# EAGLE design encoder (EAGLE 6.5.0)
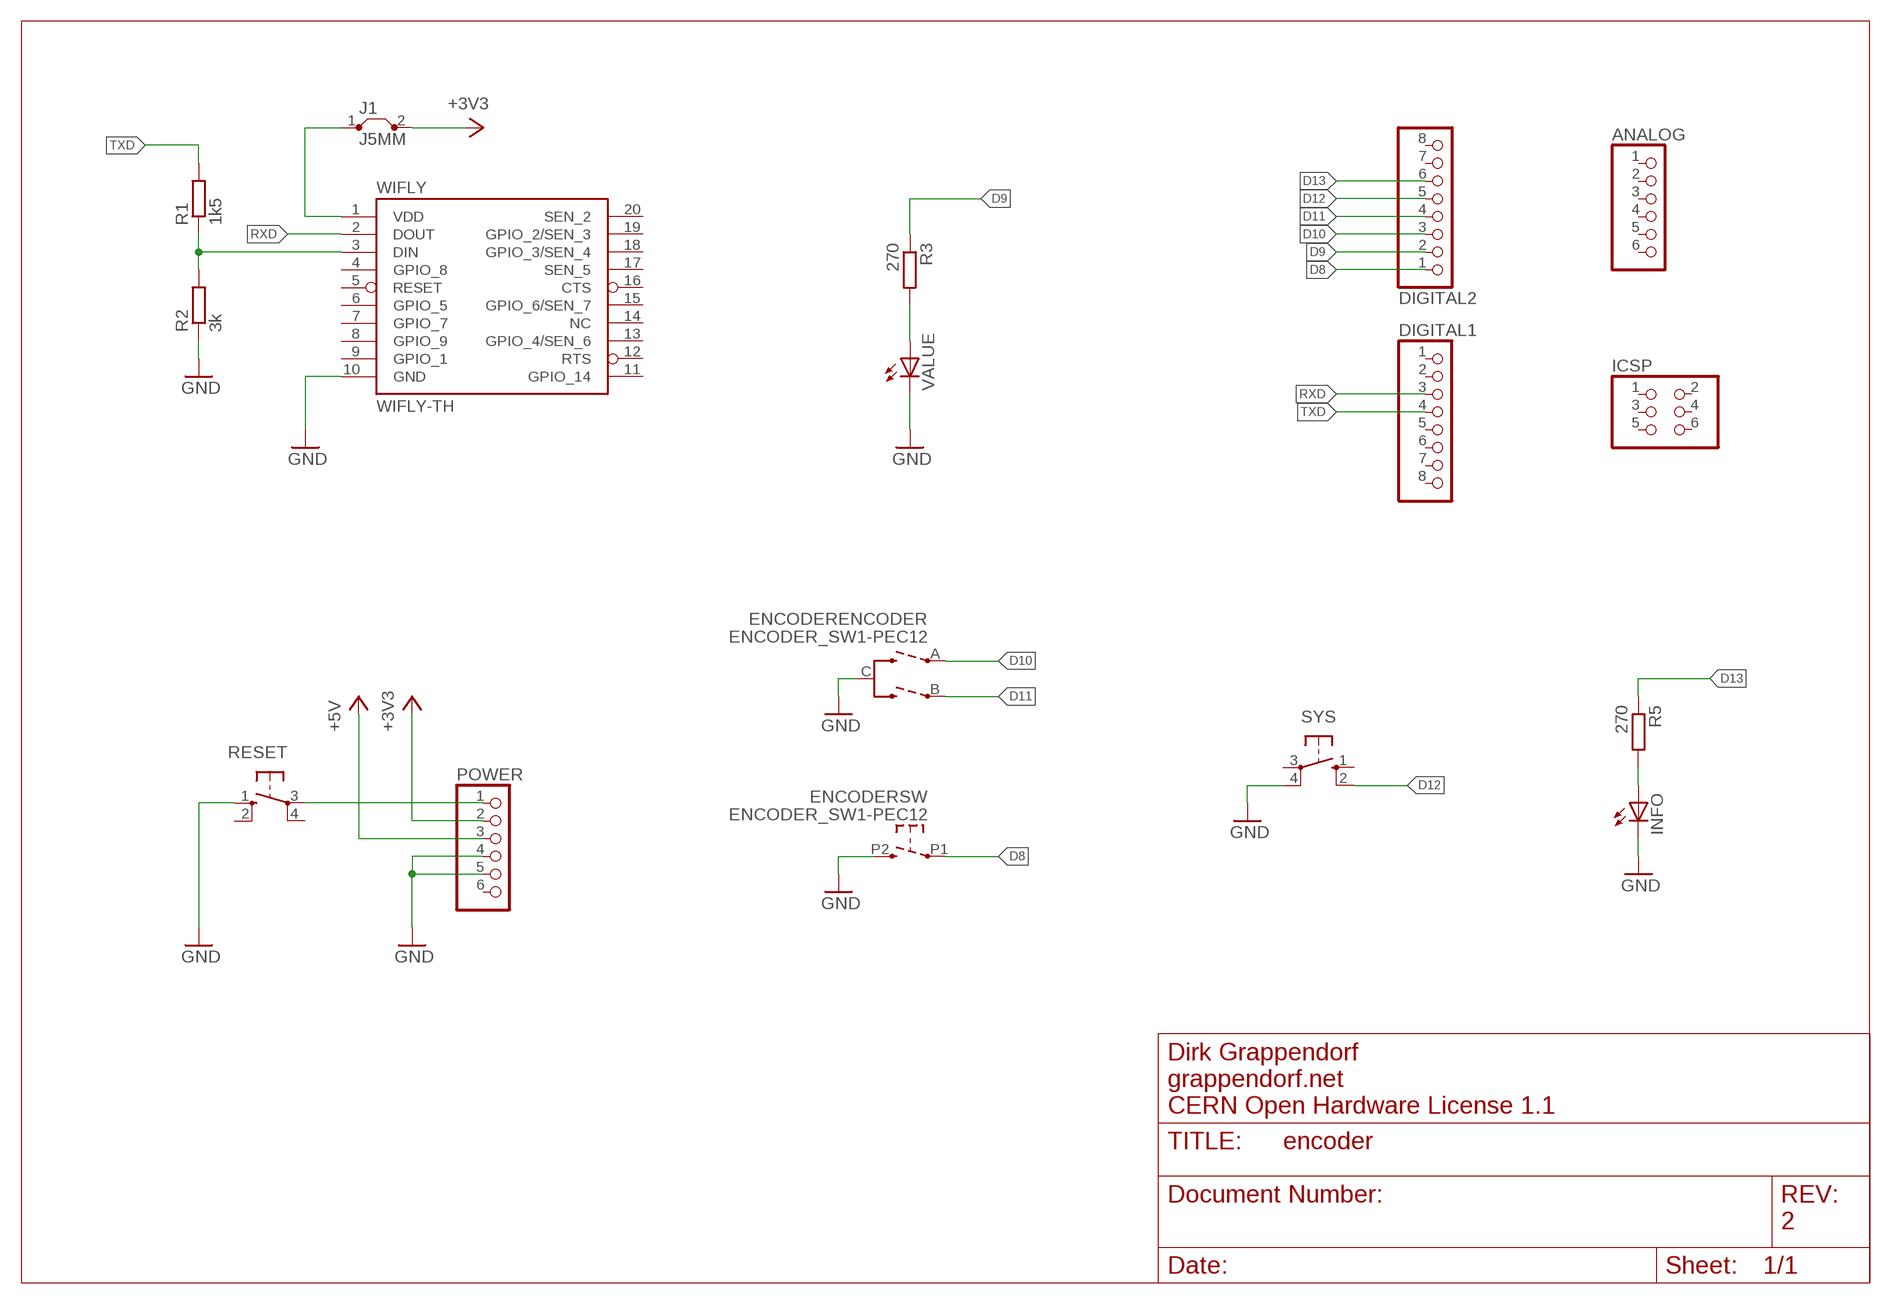
[diagram p0: schematic, sheet 1]

## Parts
ANALOG  PINHD-1X6  [1X06]
DIGITAL1  PINHD-1X8TH  [1X08-TH]
DIGITAL2  PINHD-1X8_2.54  [1X08]
ENCODER  ENCODER_SW1-PEC12  [PEC12_INCREMENTAL_ENCODER]
ICSP  PINHD-2X3  [2X03]
INFO  LED3MM  [LED3MM]
J1  J5MM  [05]
POWER  PINHD-1X6_2.54  [1X06]
R1  1k5  R-EU_0204/7  [0204/7]
R2  3k  R-EU_0204/7  [0204/7]
R3  270  R-EU_0204/7  [0204/7]
R5  270  R-EU_0204/7  [0204/7]
RESET  10-XX  [B3F-10XX]
SYS  10-XX  [B3F-10XX]
VALUE  LED3MM  [LED3MM]
WIFLY  WIFLY-TH  [WIFLY-TH]

## Nets
+3V3: J1.2 POWER.2
+5V: POWER.3
D8: DIGITAL2.1 ENCODER.P1
D9: DIGITAL2.2 R3.1
D10: DIGITAL2.3 ENCODER.A(ENCODER:A)
D11: DIGITAL2.4 ENCODER.B(ENCODER:B)
D12: DIGITAL2.5 SYS.2(S1)
D13: DIGITAL2.6 R5.1
GND: ENCODER.C(ENCODER:C) ENCODER.P2 INFO.K(C) POWER.4 POWER.5 R2.1 RESET.1(S) SYS.4(P1) VALUE.K(C) WIFLY.10(GND)
N$1: R1.1 R2.2 WIFLY.3(DIN)
N$2: POWER.1 RESET.3(P)
N$3: J1.1 WIFLY.1(VDD)
N$4: R3.2 VALUE.A
N$7: INFO.A R5.2
RXD: DIGITAL1.3 WIFLY.2(DOUT)
TXD: DIGITAL1.4 R1.2
Unconnected: ANALOG.1 ANALOG.2 ANALOG.3 ANALOG.4 ANALOG.5 ANALOG.6 DIGITAL1.1 DIGITAL1.2 DIGITAL1.5 DIGITAL1.6 DIGITAL1.7 DIGITAL1.8 DIGITAL2.7 DIGITAL2.8 ICSP.1 ICSP.2 ICSP.3 ICSP.4 ICSP.5 ICSP.6 POWER.6 RESET.2(S1) RESET.4(P1) SYS.1(S) SYS.3(P) WIFLY.4(GPIO_8) WIFLY.5(RESET) WIFLY.6(GPIO_5) WIFLY.7(GPIO_7) WIFLY.8(GPIO_9) WIFLY.9(GPIO_1) WIFLY.11(GPIO_14) WIFLY.12(RTS) WIFLY.13(GPIO_4/SEN_6) WIFLY.14(NC) WIFLY.15(GPIO_6/SEN_7) WIFLY.16(CTS) WIFLY.17(SEN_5) WIFLY.18(GPIO_3/SEN_4) WIFLY.19(GPIO_2/SEN_3) WIFLY.20(SEN_2)

## Notes on the sheet
- Dirk Grappendorf
- grappendorf.net
- CERN Open Hardware License 1.1
- 2

## Library data of the parts
ANALOG = pinhead:PINHD-1X6: PIN HEADER
DIGITAL1 = SmartPrj:PINHD-1X8: PIN HEADER
DIGITAL2 = pinhead-1:PINHD-1X8: PIN HEADER
ENCODER = dp_devices:ENCODER_SW1: Incremental Encoder with push switch
ICSP = SmartPrj:PINHD-2X3: PIN HEADER
INFO VALUE = led:LED: LED OSRAM: - CHIPLED LG R971, LG N971, LY N971, LG Q971, LY Q971, LO R971, LY R971 LH N974, LH R974 LS Q976, LO Q976, LY Q976 LO Q996 - Hyper CHIPLED LW Q18S LB Q993, LB Q99A, LB R99A - SideLED LS A670, LO A670, LY A670, LG A670, LP A670 LB A673, LV A673, LT A673, LW A673 LH A674 LY A675 LS A676, LA A676, LO A676, LY A676, LW A676 LS A679, LY A679, LG A679 - Hyper Micro SIDELED® LS Y876, LA Y876, LO Y876, LY Y876 LT Y87S - SmartLED LW L88C, LW L88S LB L89C, LB L89S, LG L890 LS L89K, LO L89K, LY L89K LS L896, LA L896, LO L896, LY L896 - TOPLED LS T670, LO T670, LY T670, LG T670, LP T670 LSG T670, LSP T670, LSY T670, LOP T670, LYG T670 LG T671, LOG T671, LSG T671 LB T673, LV T673, LT T673, LW T673 LH T674 LS T676, LA T676, LO T676, LY T676, LB T676, LH T676, LSB T676, LW T676 LB T67C, LV T67C, LT T67C, LS T67K, LO T67K, LY T67K, LW E67C LS E67B, LA E67B, LO E67B, LY E67B, LB E67C, LV E67C, LT E67C LW T67C LS T679, LY T679, LG T679 LS T770, LO T770, LY T770, LG T770, LP T770 LB T773, LV T773, LT T773, LW T773 LH T774 LS E675, LA E675, LY E675, LS T675 LS T776, LA T776, LO T776, LY T776, LB T776 LHGB T686 LT T68C, LB T68C - Hyper Mini TOPLED® LB M676 - Mini TOPLED Santana® LG M470 LS M47K, LO M47K, LY M47K Source: http://www.osram.convergy.de LUXEON: - LUMILED® LXK2-PW12-R00, LXK2-PW12-S00, LXK2-PW14-U00, LXK2-PW14-V00 LXK2-PM12-R00, LXK2-PM12-S00, LXK2-PM14-U00 LXK2-PE12-Q00, LXK2-PE12-R00, LXK2-PE12-S00, LXK2-PE14-T00, LXK2-PE14-U00 LXK2-PB12-K00, LXK2-PB12-L00, LXK2-PB12-M00, LXK2-PB14-N00, LXK2-PB14-P00, LXK2-PB14-Q00 LXK2-PR12-L00, LXK2-PR12-M00, LXK2-PR14-Q00, LXK2-PR14-R00 LXK2-PD12-Q00, LXK2-PD12-R00, LXK2-PD12-S00 LXK2-PH12-R00, LXK2-PH12-S00 LXK2-PL12-P00, LXK2-PL12-Q00, LXK2-PL12-R00 Source: www.luxeon.com KINGBRIGHT: KA-3528ASYC Source: www.kingbright.com
J1 = jumper:J: Bridge
POWER = pinhead-1:PINHD-1X6: PIN HEADER
R1-R3 R5 = rcl:R-EU_: RESISTOR, European symbol
RESET SYS = switch-omron:10-XX: OMRON SWITCH
WIFLY = grapelabs:WIFLY

## Board
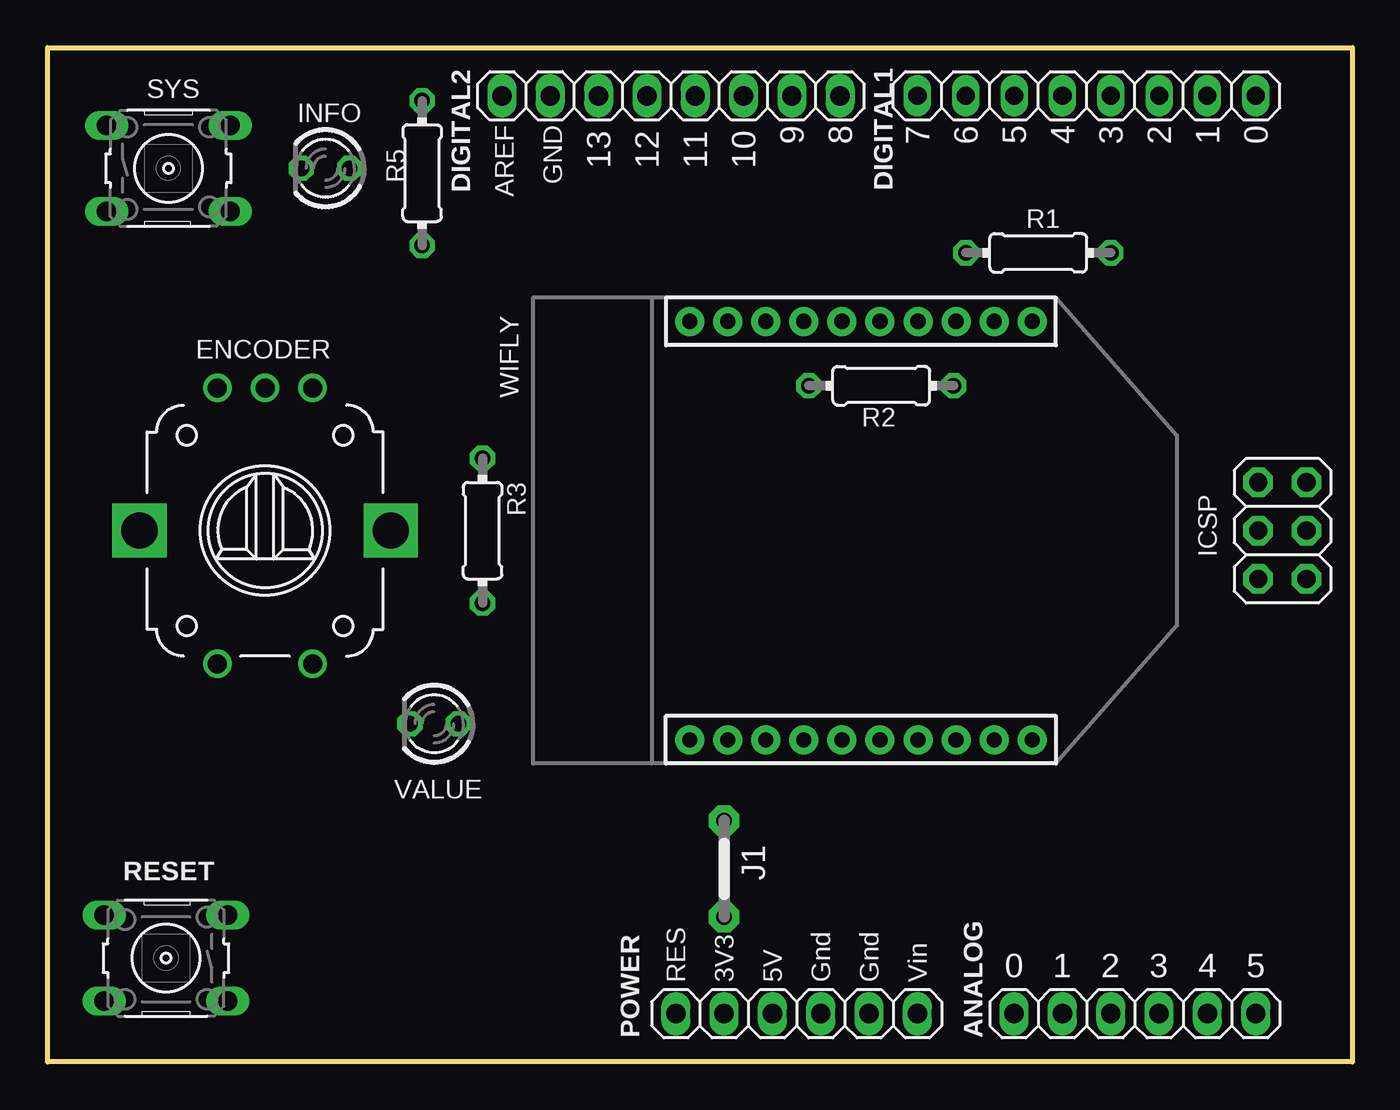
[diagram p1: board, top side]
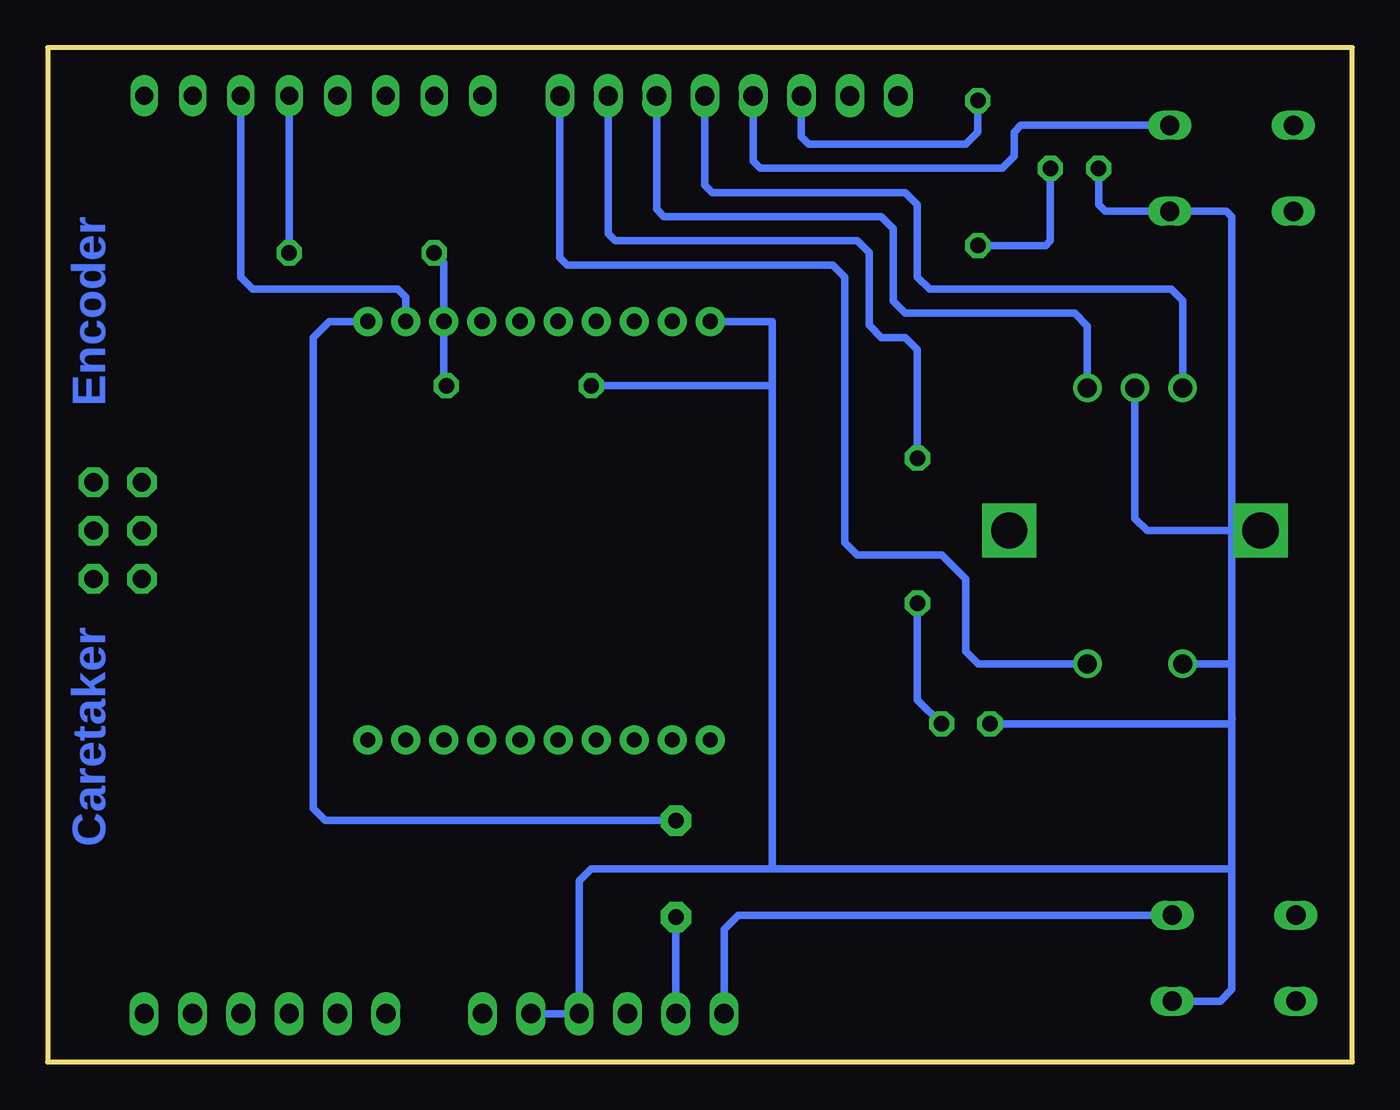
[diagram p2: board, bottom side, seen from below]

Size 68.58 x 53.34 mm. Coordinates in mm from the lower left corner, seen from the top.
Outline: 68.58,53.34 68.58,0 0,0 0,53.34 68.58,53.34
Copper layers (1*16): Top 0.035mm / dielectric 1.5mm / Bottom 0.035mm
Design rules "default": minimum track width 10mil, minimum drill 24mil, track to track 8mil, track to pad 8mil, pad to pad 8mil, via to via 8mil, smd to smd 8mil, copper to edge 40mil, drill to drill 8mil, minimum pad ring 10mil, minimum via ring 8mil, stop-mask expansion 2mil, vias tented up to drill 0mil, thermal gap 10mil

### Footprints (pad centres in the part's own frame; a part is rotated, then mirrored left to right if it is on the bottom)
1X06 = drill 1.016 long: 1 -6.35,0; 2 -3.81,0; 3 -1.27,0; 4 1.27,0; 5 3.81,0; 6 6.35,0
1X08-TH = drill 0.95 pad 1.422 long: 1 -8.89,0; 2 -6.35,0; 3 -3.81,0; 4 -1.27,0; 5 1.27,0; 6 3.81,0; 7 6.35,0; 8 8.89,0
1X08 = drill 1.016 long: 1 -8.89,0; 2 -6.35,0; 3 -3.81,0; 4 -1.27,0; 5 1.27,0; 6 3.81,0; 7 6.35,0; 8 8.89,0
PEC12_INCREMENTAL_ENCODER = drill 1: A -2.5,-7.5; B 2.5,-7.5; C 0,-7.5; P1 -2.5,7; P2 2.5,7 | drill 1.9 square: GND@1 -6.6,0; GND@2 6.6,0
2X03 = drill 0.95 pad 1.55 octagon: 1 -2.54,-1.27; 2 -2.54,1.27; 3 0,-1.27; 4 0,1.27; 5 2.54,-1.27; 6 2.54,1.27
LED3MM = drill 0.813 octagon: A -1.27,0; K 1.27,0
05 = drill 0.813 pad 1.6 octagon: 1 -2.54,0; 2 2.54,0
0204/7 = drill 0.813 octagon: 1 -3.81,0; 2 3.81,0
B3F-10XX = drill 1.016 long: 1 -3.251,2.261; 2 3.251,2.261; 3 -3.251,-2.261; 4 3.251,-2.261
WIFLY-TH = drill 0.8 pad 1.524: 1 -11,20; 2 -11,18; 3 -11,16; 4 -11,14; 5 -11,12; 6 -11,10; 7 -11,8; 8 -11,6; 9 -11,4; 10 -11,2; 11 11,2; 12 11,4; 13 11,6; 14 11,8; 15 11,10; 16 11,12; 17 11,14; 18 11,16; 19 11,18; 20 11,20

### Placement (x,y rotation side)
ANALOG  57.15,2.54 0 top
DIGITAL1  54.61,50.8 180 top
DIGITAL2  32.77,50.8 180 top
ENCODER  11.43,27.94 180 top
ICSP  64.9,27.94 270 top
INFO  14.61,46.99 180 top
J1  35.56,10.16 270 top
POWER  39.37,2.54 0 top
R1  52.07,42.55 0 top
R2  43.81,35.56 0 top
R3  22.86,27.94 270 top
R5  19.68,46.74 270 top
RESET  6.22,5.46 180 top
SYS  6.35,46.99 0 top
VALUE  20.32,17.78 180 top
WIFLY  31.75,27.94 270 top

### Tracks (layer width: path | path; a pad name or v marks a point on that pad's centre or on a via)
+3V3
  Bottom 0.406: POWER.2 J1.2
D8
  Bottom 0.406: ENCODER.P1 19.67,20.94 20.32,21.59 20.32,25.4 21.59,26.67 26.04,26.67 26.67,27.3 26.67,41.27 27.3,41.91 41.27,41.91 41.66,42.29 DIGITAL2.1
D9
  Bottom 0.406: R3.1 22.86,37.47 23.5,38.1 24.77,38.1 25.4,38.73 25.4,42.55 26.04,43.18 38.73,43.18 39.12,43.56 DIGITAL2.2
D10
  Bottom 0.406: ENCODER.A 13.93,38.7 14.61,39.37 23.5,39.37 24.13,40.01 24.13,43.81 24.77,44.45 36.2,44.45 36.58,44.83 DIGITAL2.3
D11
  Bottom 0.406: ENCODER.B 8.93,40.05 9.53,40.64 22.23,40.64 22.86,41.27 22.86,45.09 23.5,45.72 33.66,45.72 34.04,46.1 DIGITAL2.4
D12
  Bottom 0.406: DIGITAL2.5 31.5,47.37 31.11,46.99 18.41,46.99 17.78,47.62 17.78,48.9 17.42,49.25 SYS.2
D13
  Bottom 0.406: R5.1 19.68,48.9 20.32,48.26 28.57,48.26 28.96,48.64 DIGITAL2.6
GND
  Bottom 0.406: POWER.5 POWER.4 40.64,9.53 40.01,10.16 30.48,10.16 | R2.1 30.48,35.56 | RESET.1 6.96,3.2 6.35,3.81 6.35,10.16 | WIFLY.10 30.48,38.94 30.48,35.56 | 6.35,10.16 6.35,11.43 6.35,17.78 | 6.35,17.78 6.35,18.03 6.33,18.06 6.35,18.09 6.35,20.32 6.35,20.95 | 6.35,27.94 6.35,28.57 6.35,30.86 6.35,33.02 6.35,44.45 6.63,44.73 SYS.4 12.98,44.73 13.34,45.09 INFO.K | 6.35,27.94 6.35,20.95 | 30.48,10.16 6.35,10.16 | 30.48,35.56 30.48,10.16 | ENCODER.P2 6.37,20.94 6.35,20.95 | ENCODER.C 11.43,28.57 10.79,27.94 6.35,27.94 | VALUE.K 6.35,17.78
N$1
  Bottom 0.406: R2.2 47.75,35.69 WIFLY.3 47.75,42.03 R1.1
N$2
  Bottom 0.406: RESET.3 32.28,7.72 33.02,6.99 POWER.1
N$3
  Bottom 0.406: WIFLY.1 53.77,38.94 54.61,38.1 54.61,13.34 53.98,12.7 J1.1
N$4
  Bottom 0.406: R3.2 22.86,19.05 VALUE.A
N$7
  Bottom 0.406: R5.2 16.13,42.93 15.88,43.18 INFO.A
RXD
  Bottom 0.406: WIFLY.2 49.75,40.23 50.16,40.64 57.78,40.64 58.42,41.27 DIGITAL1.3
TXD
  Bottom 0.406: DIGITAL1.4 R1.2

### Text on the board
Bottom: Encoder | Caretaker
tPlace: 9 | 8 | 7 | 6 | 5 | 4 | 3 | 2 | 1 | 0 | 13 | 12 | 11 | 10
tNames: AREF | GND | RES | 3V3 | 5V | Gnd | Gnd | Vin | 0 | 1 | 2 | 3 | 4 | 5
bStop: 1 | 2 | 3 | 4 | 5 | 6
Reference: USB | ETH